# Altium schematic sheet phase_sense.SchDoc
size A
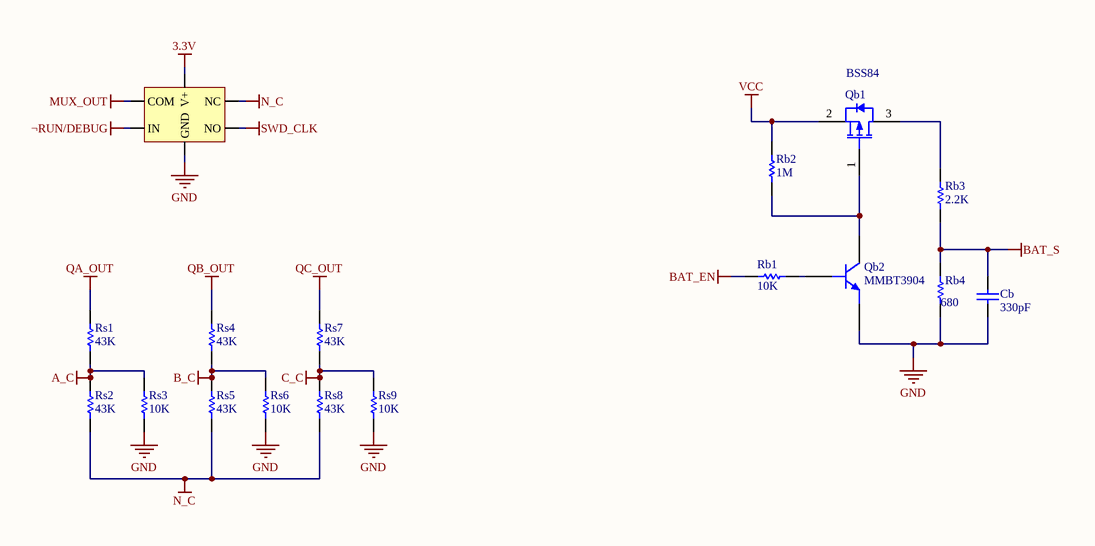
[diagram p0: phase_sense.SchDoc]

## Parts
Cb  330pF  [CAPC2012L]
MUX  TS5A3159A  [JEDEC_MO-178AB]  (value not drawn)
Qb1  BSS84  [SOT23-3L]
Qb2  value MMBT3904  [SOT23-3L]  (hidden comment: BJT-NPN-BEC)
Rb1  10K  [RESC1608L]
Rb2  1M  [RESC1608L]
Rb3  2.2K  [RESC1608L]
Rb4  680  [RESC1608L]
Rs1  43K  [RESC1608L]
Rs2  43K  [RESC1608L]
Rs3  10K  [RESC1608L]
Rs4  43K  [RESC1608L]
Rs5  43K  [RESC1608L]
Rs6  10K  [RESC1608L]
Rs7  43K  [RESC1608L]
Rs8  43K  [RESC1608L]
Rs9  10K  [RESC1608L]

## Nets
3.3V: MUX.5(V+)
A_C: Rs1.2 Rs2.1 Rs3.1
B_C: Rs4.2 Rs5.1 Rs6.1
BAT_EN: Rb1.2
BAT_S: Cb.1 Rb3.2 Rb4.1
C_C: Rs7.2 Rs8.1 Rs9.1
GND: Cb.2 MUX.2(GND) Qb2.2(E) Rb4.2 Rs3.2 Rs6.2 Rs9.2
MUX_OUT: MUX.4(COM)
N_C: MUX.3(NC) Rs2.2 Rs5.2 Rs8.2
QA_OUT: Rs1.1
QB_OUT: Rs4.1
QC_OUT: Rs7.1
SWD_CLK: MUX.1(NO)
VCC: Qb1.2(S) Rb2.1
¬RUN/DEBUG: MUX.6(IN)
NetQb1_1: Qb1.1(G) Qb2.3(C) Rb2.2
NetQb1_3: Qb1.3(D) Rb3.1
NetQb2_1: Qb2.1(B) Rb1.1

## Library data of the parts
Cb = CAP_330p_0805_100V_NP0_10%: CAP CER 330PF 100V 5% NP0 0805; Manufacturer Part Number: CL21C331JCANNNC; Name: CAP_330p_0805_100V_NP0_10%; Value: 330pF; Supplier 1: Digi-Key; Supplier Part Number 1: 1276-2646-1-ND
MUX = x-TI_TS5A3159A: IC SWITCH SPDT SOT23-6; Manufacturer: "Texas Instruments"; Manufacturer Part Number: TS5A3159ADBVR; Name: x-TI_TS5A3159A; Supplier 1: Digi-Key; Supplier Part Number 1: 296-19265-1-ND
Qb1 = BSS84: MOSFET P-CH 50V 130MA SOT-23; Manufacturer: Fairchild Semiconductor; Name: BSS84; Value: BSS84; Manufacturer Part Number: BSS84; Supplier 1: Digi-Key; Supplier Part Number 1: BSS84CT-ND
Qb2 = MMBT3904: TRANSISTOR NPN 40V 0.2A SOT23; Manufacturer: NXP Semiconductors; Name: MMBT3904; Manufacturer Part Number: MMBT3904; Supplier 1: Digi-Key; Supplier Part Number 1: 568-4510-1-ND
Rb1 Rs1-Rs9 = RES_10K_0603_0W1_1%: RES 10K OHM 1/10W 5% 0603; Manufacturer Part Number: RC1608J103CS; Name: RES_10K_0603_0W1_1%; Value: 10K; Supplier 1: Digi-Key; Supplier Part Number 1: 1276-5086-1-ND
Rb2 = RES_1M_0603_0W1_1%: RES 1.00M OHM 1/10W 1% 0603 SMD; Manufacturer: Yageo; Manufacturer Part Number: RC0603FR-071ML; Name: RES_1M_0603_0W1_1%; Value: 1M; Supplier 1: Digi-Key; Supplier Part Number 1: 311-1.00MHRCT-ND
Rb3 = RES_2K2_0603_0W1_1%: RES 2.2K OHM 1/10W 1% 0603 SMD; Manufacturer: Rohm Semiconductor; Manufacturer Part Number: MCR03ERTF2201; Name: RES_2K2_0603_0W1_1%; Value: 2.2K; Supplier 1: Digi-Key; Supplier Part Number 1: RHM2.20KCFCT-ND
Rb4 = RES_680_0603_0W1_1%: RES 680 OHM 1/10W 1% 0603 SMD; Manufacturer: Rohm Semiconductor; Manufacturer Part Number: MCR03ERTF6800; Name: RES_680_0603_0W1_1%; Value: 680; Supplier 1: Digi-Key; Supplier Part Number 1: RHM680CFCT-ND